# EAGLE schematic eeZeeProp (EAGLE 6.1)
DATABASE: ./../../eagle/PARTSDB.txt
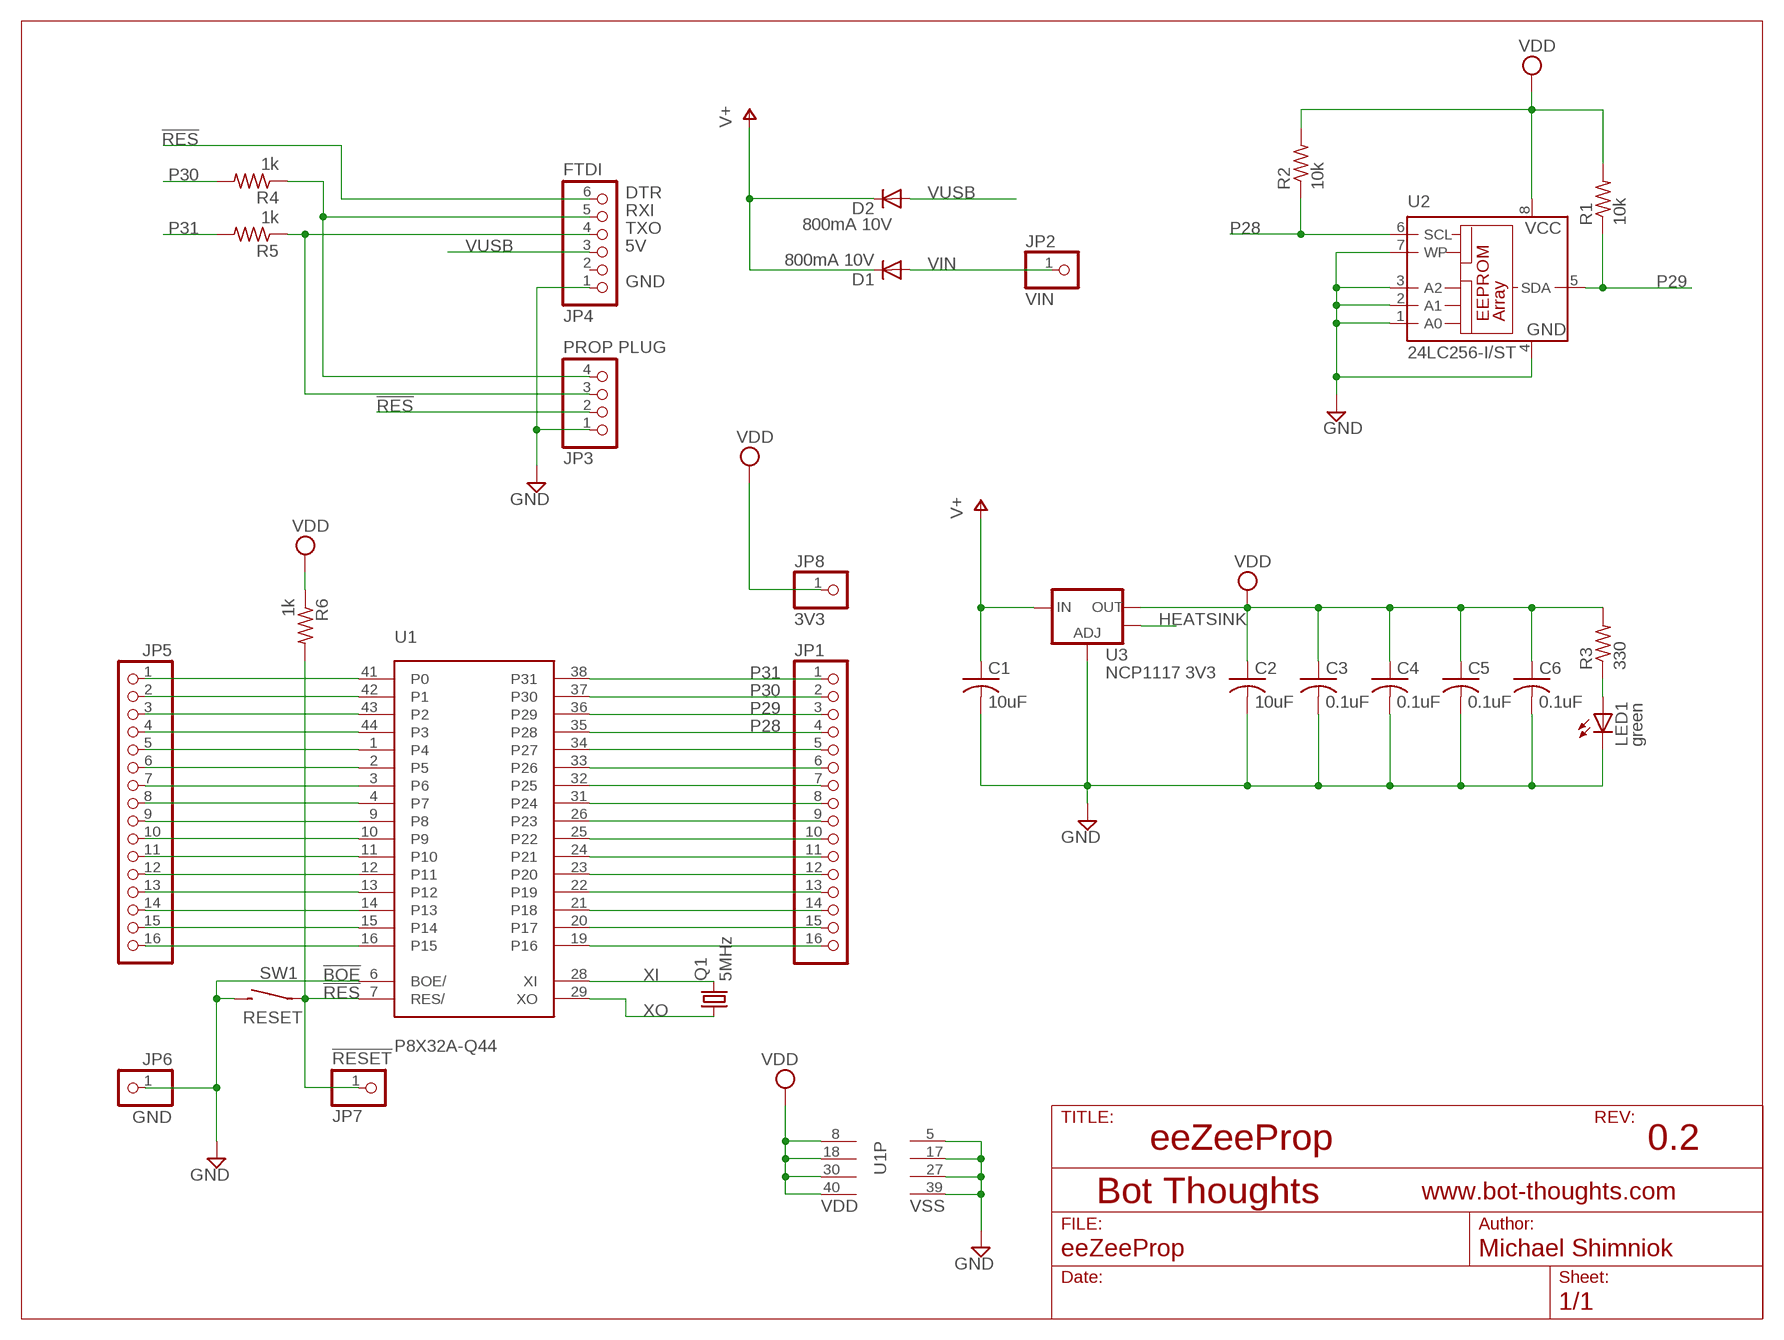
[diagram p0: schematic, sheet 1]

## Parts
C1  10uF  C-USC1206  [C1206]
C2  10uF  C-USC1206  [C1206]
C3  0.1uF  C-USC0603  [C0603]
C4  0.1uF  C-USC0603  [C0603]
C5  0.1uF  C-USC0603  [C0603]
C6  0.1uF  C-USC0603  [C0603]
D1  800mA 10V  DIODE-SOD323-R  [SOD323-R]
D2  800mA 10V  DIODE-SOD323-R  [SOD323-R]
JP1  PINHD-1X16_2.54-S  [1X16-S]
JP2  VIN  PINHD-1X01_2.54  [1X01]
JP3  PROP PLUG  PINHD-1X04_2.54-90°-S  [1X04/90-S]
JP4  FTDI  PINHD-1X06_2.54-S  [1X06-S]
JP5  PINHD-1X16_2.54-S  [1X16-S]
JP6  GND  PINHD-1X01_2.54  [1X01]
JP7  !RESET  PINHD-1X01_2.54  [1X01]
JP8  3V3  PINHD-1X01_2.54  [1X01]
LED1  green  LEDCHIPLED_1206  [CHIPLED_1206]
Q1  5MHz  CRYSTALHC49U-V  [HC49U-V]
R1  10k  R-US_R0603  [R0603]
R2  10k  R-US_R0603  [R0603]
R3  330  R-US_R0603  [R0603]
R4  1k  R-US_R0603  [R0603]
R5  1k  R-US_R0603  [R0603]
R6  1k  R-US_R0603  [R0603]
SW1  RESET  SPST_TAC_RECT1  [6MMTACTILE_RECT]
U1  P8X32A-Q44  [P8X32A-Q44]
U2  24LC256-I/ST  24LC128SN  [SO-08]
U3  NCP1117 3V3  V_REG_LM1117SOT223  [SOT223]

## Nets
!RES: JP3.2 JP4.6 JP7.1 R6.2 SW1.P$1(P) U1.7(RES/)
GND: C1.2 C2.2 C3.2 C4.2 C5.2 C6.2 JP3.1 JP4.1 JP6.1 LED1.C SW1.P$2(S) U1.5(VSS) U1.6(BOE/) U1.17(VSS) U1.27(VSS) U1.39(VSS) U2.1(A0) U2.2(A1) U2.3(A2) U2.4(GND) U2.7(WP) U3.1(ADJ)
HEATSINK: U3.4(OUT)
N$1: JP5.1 U1.41(P0)
N$2: JP5.2 U1.42(P1)
N$3: JP5.3 U1.43(P2)
N$4: JP5.4 U1.44(P3)
N$5: LED1.A R3.1
N$6: JP5.5 U1.1(P4)
N$8: JP5.6 U1.2(P5)
N$9: JP5.7 U1.3(P6)
N$10: JP5.8 U1.4(P7)
N$11: JP5.9 U1.9(P8)
N$12: JP5.10 U1.10(P9)
N$13: JP5.11 U1.11(P10)
N$14: JP5.12 U1.12(P11)
N$15: JP5.13 U1.13(P12)
N$16: JP5.14 U1.14(P13)
N$17: JP5.15 U1.15(P14)
N$18: JP5.16 U1.16(P15)
N$19: JP1.5 U1.34(P27)
N$20: JP1.6 U1.33(P26)
N$21: JP1.7 U1.32(P25)
N$22: JP1.8 U1.31(P24)
N$23: JP1.9 U1.26(P23)
N$24: JP1.10 U1.25(P22)
N$25: JP1.11 U1.24(P21)
N$26: JP1.12 U1.23(P20)
N$27: JP1.13 U1.22(P19)
N$28: JP1.14 U1.21(P18)
N$29: JP1.15 U1.20(P17)
N$30: JP1.16 U1.19(P16)
N$34: JP3.4 JP4.5 R4.1
N$35: JP3.3 JP4.4 R5.1
P28: JP1.4 R2.1 U1.35(P28) U2.6(SCL)
P29: JP1.3 R1.1 U1.36(P29) U2.5(SDA)
P30: JP1.2 R4.2 U1.37(P30)
P31: JP1.1 R5.2 U1.38(P31)
V+: C1.1 D1.C D2.C U3.3(IN)
VDD: C2.1 C3.1 C4.1 C5.1 C6.1 JP8.1 R1.2 R2.2 R3.2 R6.1 U1.8(VDD) U1.18(VDD) U1.30(VDD) U1.40(VDD) U2.8(VCC) U3.2(OUT)
VIN: D1.A JP2.1
VUSB: D2.A JP4.3
XI: Q1.2 U1.28(XI)
XO: Q1.1 U1.29(XO)
Unconnected: JP4.2

## Notes on the sheet
- DTR
- RXI
- TXO
- 5V
- GND
- !BOE
- eeZeeProp | 0.2

## Library data of the parts
C1 C2 = rcl:C-US: CAPACITOR, American symbol; PARTNO: T491A106M006AT; SIZE: (0603); TC: X5R; TOL: 20%; TYPE: CER; VOLT: 10V
C3-C6 = rcl:C-US: CAPACITOR, American symbol; PARTNO: 0603YC104KAT2A; SIZE: (0603); TC: X5R; TOL: 20%; TYPE: CER; VOLT: 10V
D1 D2 = diode:DIODE-: DIODE; PARTNO: PMEG2015EA,115
JP1 JP5 = pinhead-2:PINHD-1X16: PIN HEADER
JP2 JP6-JP8 = pinhead-2:PINHD-1X01: PIN HEADER
JP3 = pinhead-2:PINHD-1X04: PIN HEADER
JP4 = pinhead-2:PINHD-1X06: PIN HEADER; PARTNO: 2211S-06G
LED1 = led:LED: LED OSRAM: - CHIPLED LG R971, LG N971, LY N971, LG Q971, LY Q971, LO R971, LY R971 LH N974, LH R974 LS Q976, LO Q976, LY Q976 LO Q996 - Hyper CHIPLED LW Q18S LB Q993, LB Q99A, LB R99A - SideLED LS A670, LO A670, LY A670, LG A670, LP A670 LB A673, LV A673, LT A673, LW A673 LH A674 LY A675 LS A676, LA A676, LO A676, LY A676, LW A676 LS A679, LY A679, LG A679 - Hyper Micro SIDELED® LS Y876, LA Y876, LO Y876, LY Y876 LT Y87S - SmartLED LW L88C, LW L88S LB L89C, LB L89S, LG L890 LS L89K, LO L89K, LY L89K LS L896, LA L896, LO L896, LY L896 - TOPLED LS T670, LO T670, LY T670, LG T670, LP T670 LSG T670, LSP T670, LSY T670, LOP T670, LYG T670 LG T671, LOG T671, LSG T671 LB T673, LV T673, LT T673, LW T673 LH T674 LS T676, LA T676, LO T676, LY T676, LB T676, LH T676, LSB T676, LW T676 LB T67C, LV T67C, LT T67C, LS T67K, LO T67K, LY T67K, LW E67C LS E67B, LA E67B, LO E67B, LY E67B, LB E67C, LV E67C, LT E67C LW T67C LS T679, LY T679, LG T679 LS T770, LO T770, LY T770, LG T770, LP T770 LB T773, LV T773, LT T773, LW T773 LH T774 LS E675, LA E675, LY E675, LS T675 LS T776, LA T776, LO T776, LY T776, LB T776 LHGB T686 LT T68C, LB T68C - Hyper Mini TOPLED® LB M676 - Mini TOPLED Santana® LG M470 LS M47K, LO M47K, LY M47K Source: http://www.osram.convergy.de LUXEON: - LUMILED® LXK2-PW12-R00, LXK2-PW12-S00, LXK2-PW14-U00, LXK2-PW14-V00 LXK2-PM12-R00, LXK2-PM12-S00, LXK2-PM14-U00 LXK2-PE12-Q00, LXK2-PE12-R00, LXK2-PE12-S00, LXK2-PE14-T00, LXK2-PE14-U00 LXK2-PB12-K00, LXK2-PB12-L00, LXK2-PB12-M00, LXK2-PB14-N00, LXK2-PB14-P00, LXK2-PB14-Q00 LXK2-PR12-L00, LXK2-PR12-M00, LXK2-PR14-Q00, LXK2-PR14-R00 LXK2-PD12-Q00, LXK2-PD12-R00, LXK2-PD12-S00 LXK2-PH12-R00, LXK2-PH12-S00 LXK2-PL12-P00, LXK2-PL12-Q00, LXK2-PL12-R00 Source: www.luxeon.com KINGBRIGHT: KA-3528ASYC Source: www.kingbright.com; PARTNO: LG N971-KN-1
Q1 = crystal:CRYSTAL: CRYSTAL; OC_FARNELL: 1666969; OC_NEWARK: unknown; PARTNO: HC49US-5.000MABJ-UB
R1 R2 = rcl:R-US_: RESISTOR, American symbol; PARTNO: ERJ-3GEYJ103V; RATE: 100mW; SIZE: (0603); TOL: 5%
R3 = rcl:R-US_: RESISTOR, American symbol; PARTNO: ERJ-3GEYJ331V
R4-R6 = rcl:R-US_: RESISTOR, American symbol; PARTNO: RC0603JR-071KL; RATE: 100mW; SIZE: (0603); TOL: 5%
SW1 = mes_electromech:SPST: SPST SWITCH; PARTNO: MJTP1243
U1 = parallax_propeller:P8X32A-Q44; PARTNO: P8X32A-Q44
U2 = microchip:24*: Serial EEPROM I2C; MF: OnSemi; MPN: CAT24C256WI-GT3; OC_FARNELL: 9757937; OC_NEWARK: 30H1511; PARTNO: CAT24C256WI-GT3
U3 = SparkFun:V_REG_LM1117: Voltage Regulator LM1117 Standard adjustable voltage regulator but in SMD form. Spark Fun Electronics SKU : COM-00595; PARTNO: SPX1117M3-L-3-3